# Altium schematic sheet DO_EZO_1.SchDoc
size A4
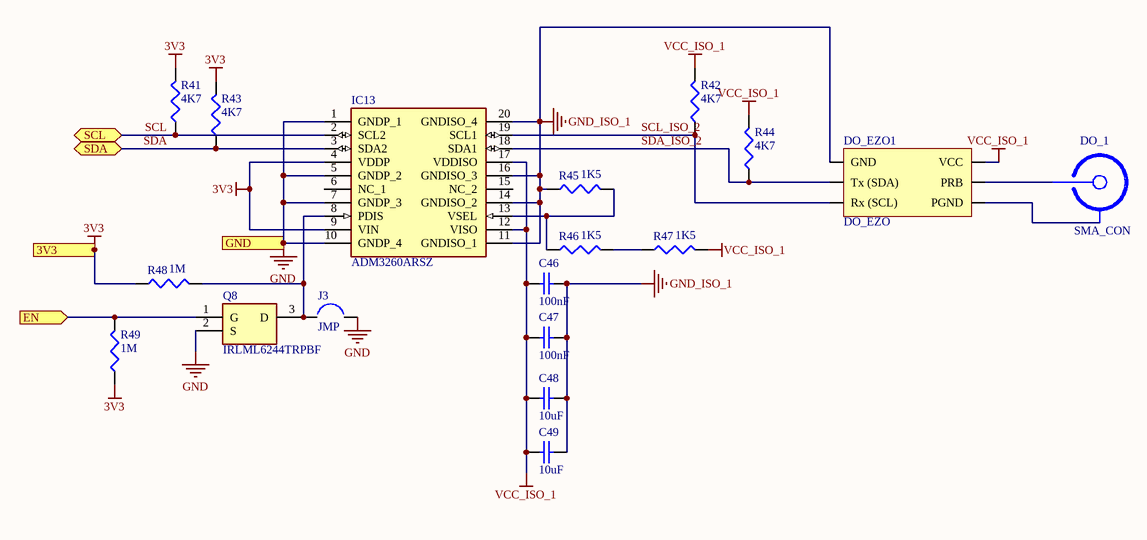
[diagram p0: DO_EZO_1.SchDoc]

## Parts
C46  100nF  [1608[0603]]
C47  100nF  [1608[0603]]
C48  10uF  [1608[0603]]
C49  10uF  [1608[0603]]
DO_1  SMA_CON  [PCBSMAFRAHT]
DO_EZO1  DO_EZO  [DO_EZO]
IC13  ADM3260ARSZ  [SOP65P780X200-20N]
J3  JMP  [Jumper]
Q8  IRLML6244TRPBF  [SOT95P237X112-3N]
R41  4K7  [J1-0603]
R42  4K7  [J1-0603]
R43  4K7  [J1-0603]
R44  4K7  [J1-0603]
R45  1K5  [J1-0603]
R46  1K5  [J1-0603]
R47  1K5  [J1-0603]
R48  1M  [J1-0603]
R49  1M  [J1-0603]

## Ports
3V3, EN (in), GND, SCL (bidir), SDA (bidir)

## Nets
3V3: IC13.4(VDDP) IC13.9(VIN) R41.2 R43.2 R48.1 R49.1 ; port 3V3
GND: IC13.1(GNDP_1) IC13.5(GNDP_2) IC13.7(GNDP_3) IC13.10(GNDP_4) J3.2 Q8.2(S) ; port GND
GND_ISO_1: C46.2 C47.2 C48.2 C49.2 DO_EZO1.1(GND) IC13.11(GNDISO_1) IC13.14(GNDISO_2) IC13.16(GNDISO_3) IC13.20(GNDISO_4) R45.1
VCC_ISO_1: C46.1 C47.1 C48.1 C49.1 DO_EZO1.4(VCC) IC13.12(VISO) IC13.17(VDDISO) R42.2 R44.2 R47.2
EN: Q8.1(G) R49.2 ; port EN
SCL: IC13.2(SCL2) R41.1 ; port SCL
SCL_ISO_2: DO_EZO1.3(Rx_(SCL)) IC13.19(SCL1) R42.1
SDA: IC13.3(SDA2) R43.1 ; port SDA
SDA_ISO_2: DO_EZO1.2(Tx_(SDA)) IC13.18(SDA1) R44.1
NetDO_1_1: DO_1.1 DO_EZO1.5(PRB)
NetDO_1_2: DO_1.2 DO_EZO1.6(PGND)
NetIC13_8: IC13.8(PDIS) J3.1 Q8.3(D) R48.2
NetIC13_13: IC13.13(VSEL) R45.2 R46.1
NetR46_2: R46.2 R47.1

Not connected (* = marked no-connect by the designer): IC13 6(NC_1) 15(NC_2)

## Library data of the parts
C46 C47 = Cap Semi: Capacitor (Semiconductor SIM Model); Published: 8-Jun-2000; LatestRevisionDate: 29-May-2009; LatestRevisionNote: IPC-7351 Footprint Added.; PackageReference: C1206; Publisher: Altium Limited; PackageDescription: Chip Capacitor; Value: 100nF
C48 C49 = Cap Semi: Capacitor (Semiconductor SIM Model); Value: 100nF; Published: 8-Jun-2000; LatestRevisionDate: 29-May-2009; LatestRevisionNote: IPC-7351 Footprint Added.; PackageReference: C1206; Publisher: Altium Limited; PackageDescription: Chip Capacitor
DO_1 = SMA: Connector; Manufacturer_Name: Taoglas; Manufacturer_Part_Number: PCB.SMAFRA.HT; Datasheet Link: https://www.mouser.com/datasheet/2/398/PCB.SMAFRA.HT_-1220750.pdf; Height: 9mm; Mouser Part Number: 960-PCB.SMAFRA.HT; Mouser Price/Stock: https://www.mouser.co.uk/ProductDetail/Taoglas/PCBSMAFRAHT?qs=RuW%2Fu%252BNMQmubIFYcN8w5Dw%3D%3D
IC13 = ADM3260ARSZ: Integrated Circuit; Manufacturer_Name: Analog Devices; Datasheet Link: http://www.farnell.com/datasheets/2037088.pdf; Height: 2mm; Manufacturer_Part_Number: ADM3260ARSZ; Mouser Part Number: 584-ADM3260ARSZ; Mouser Price/Stock: https://www.mouser.com/Search/Refine.aspx?Keyword=584-ADM3260ARSZ; RS Part Number: 8319113P; RS Price/Stock: http://uk.rs-online.com/web/p/products/8319113P
Q8 = IRLML6244TRPBF: Transistor; Manufacturer_Name: Infineon; Allied_Number: 70411468; Datasheet Link: http://www.infineon.com/dgdl/irlml6244pbf.pdf?fileId=5546d462533600a4015356686fed261f; Height: 1.12mm; Manufacturer_Part_Number: IRLML6244TRPBF; Mouser Part Number: 942-IRLML6244TRPBF; Mouser Price/Stock: https://www.mouser.com/Search/Refine.aspx?Keyword=942-IRLML6244TRPBF; RS Part Number: 7377228P; RS Price/Stock: http://at.rs-online.com/web/p/products/7377228P; Allied Price/Stock: https://www.alliedelec.com/infineon-irlml6244trpbf/70411468/
R41-R49 = Res3: Resistor; Published: 8-Jun-2000; LatestRevisionDate: 29-May-2009; LatestRevisionNote: IPC-7351 Footprint Added.; PackageReference: J1-0603; Publisher: Altium Limited; PackageDescription: Chip Resistor
  R41-R44: Value: 4K7
  R45-R47: Value: 1K5
  R48 R49: Value: 1M